# Altium schematic sheet schematic.SchDoc
size A4; SheetNumber: 1; SheetTotal: 1
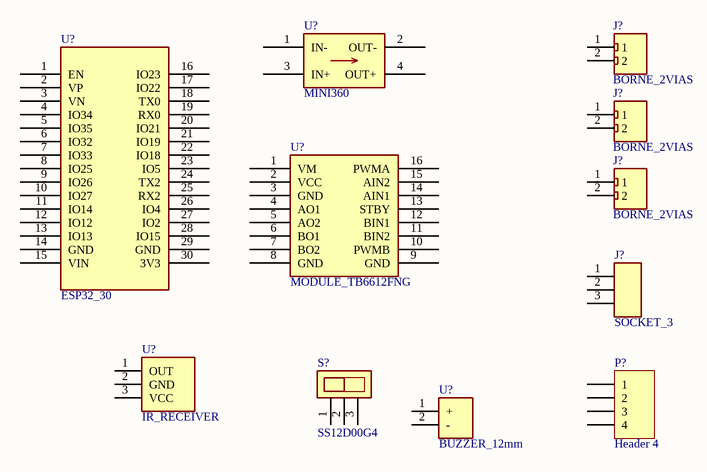
[diagram p0: schematic.SchDoc]

## Parts
(Parts that share a designator on the sheet are numbered #1, #2 ... from top to bottom, then left to right.)
J?#1  BORNE_2VIAS  [BORNE_2_VIAS]
J?#2  BORNE_2VIAS  [BORNE_2_VIAS]
J?#3  BORNE_2VIAS  [BORNE_2_VIAS]
J?#4  SOCKET_3  [SOCKET_3]
P?  Header 4  [HDR1X4]
S?  SS12D00G4  [SS12D00G4]
U?#1  MINI360  [MINI360]
U?#2  MODULE_TB6612FNG  [MODULE_TB6612FNG]
U?#3  ESP32_30  [ESP32_30]
U?#4  IR_RECEIVER  [IR_Receiver]
U?#5  BUZZER_12mm  [BUZZER_12mm]

## Nets

Not connected (* = marked no-connect by the designer): J?#1 1 2; J?#2 1 2; J?#3 1 2; J?#4 1 2 3; P? 1 2 3 4; S? 1 2 3; U?#1 1(IN-) 2(OUT-) 3(IN+) 4(OUT+); U?#2 1(VM) 2(VCC) 3(GND) 4(AO1) 5(AO2) 6(BO1) 7(BO2) 8(GND) 9(GND) 10(PWMB) 11(BIN2) 12(BIN1) 13(STBY) 14(AIN1) 15(AIN2) 16(PWMA); U?#3 1(EN) 2(VP) 3(VN) 4(IO34) 5(IO35) 6(IO32) 7(IO33) 8(IO25) 9(IO26) 10(IO27) 11(IO14) 12(IO12) 13(IO13) 14(GND) 15(VIN) 16(IO23) 17(IO22) 18(TX0) 19(RX0) 20(IO21) 21(IO19) 22(IO18) 23(IO5) 24(TX2) 25(RX2) 26(IO4) 27(IO2) 28(IO15) 29(GND) 30(3V3); U?#4 1(OUT) 2(GND) 3(VCC); U?#5 1(+) 2(-)

## Library data of the parts
P? = Header 4: Header, 4-Pin; LatestRevisionDate: 17-Jul-2002; LatestRevisionNote: Re-released for DXP Platform.; Publisher: Altium Limited
U?#1 = MINI360: MODULE BUCK STEP DOWN 3A 18x12mm; ComponentLink1Description: Datasheet; ComponentLink1URL: https://cdn-shop.adafruit.com/datasheets/MP2307_r1.9.pdf
U?#2 = MODULE_TB6612FNG: Module Dual Motor Driver 2.5-13.5V 3.2A Peak 21x18mm; ComponentLink1Description: Datasheet; ComponentLink1URL: https://www.mouser.com/datasheet/2/408/TB6612FNG_datasheet_en_20141001-708260.pdf
U?#3 = ESP32_30: Microcontoller Board 30 Pins Wifi 2.4GHz BLE 4.2 ESP32-WROOM-32D; ComponentLink1Description: Datasheet; ComponentLink1URL: https://www.mouser.com/datasheet/2/891/esp32_wroom_32d_esp32_wroom_32u_datasheet_en-1365844.pdf
U?#4 = IR_RECEIVER: INFRARED RECEIVER SENSOR; Digikey PN: 1528-157-ND; Mouser PN: 782-TSMP58138
U?#5 = BUZZER_12mm: BUZZER MAGNETIC 12MM; Digikey PN: 433-WT-1209T-ND; Mouser PN: 433-WT-1209T-ND